# EAGLE design bdebounce (EAGLE 9.6.1)
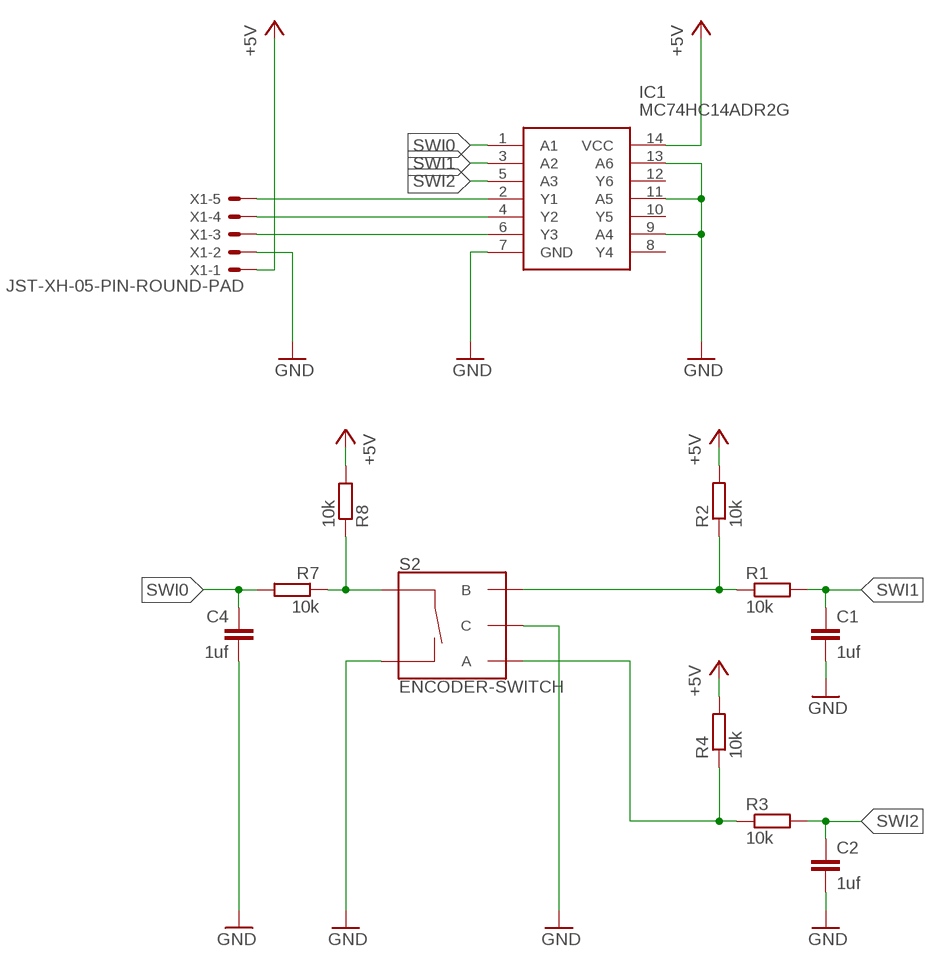
[diagram p0: schematic, sheet 1]

## Parts
C1  1uf  C-EUC0805  [C0805]
C2  1uf  C-EUC0805  [C0805]
C4  1uf  C-EUC0805  [C0805]
IC1  MC74HC14ADR2G  [SOIC127P600X175-14N]
R1  10k  R-EU_R0805  [R0805]
R2  10k  R-EU_R0805  [R0805]
R3  10k  R-EU_R0805  [R0805]
R4  10k  R-EU_R0805  [R0805]
R7  10k  R-EU_R0805  [R0805]
R8  10k  R-EU_R0805  [R0805]
S2  ENCODER-SWITCH  [ROTARY_ENC_PLAIN]
X1  JST-XH-05-PIN-ROUND-PAD  [JST-XH-05-PACKAGE-ROUND-PAD]

## Nets
+5V: IC1.14(VCC) R2.2 R4.2 R8.2 X1.1
GND: C1.2 C2.2 C4.2 IC1.7(GND) IC1.9(A4) IC1.11(A5) IC1.13(A6) S2.C S2.SW- X1.2
N$1: IC1.6(Y3) X1.3
SW0: R7.1 R8.1 S2.SW+
SW1: R1.1 R2.1 S2.B
SW2: R3.1 R4.1 S2.A
SWI0: C4.1 IC1.1(A1) R7.2
SWI1: C1.1 IC1.3(A2) R1.2
SWI2: C2.1 IC1.5(A3) R3.2
SWO0: IC1.2(Y1) X1.5
SWO1: IC1.4(Y2) X1.4
Unconnected: IC1.8(Y4) IC1.10(Y5) IC1.12(Y6)

## Library data of the parts
C1 C2 C4 = rcl:C-EU: CAPACITOR, European symbol; SPICEPREFIX: C
IC1 = MC74HC14ADR2G:MC74HC14ADR2G: ON SEMICONDUCTOR - MC74HC14ADR2G - IC, HEX INV, SCHMITT, 74HC14, SOIC14 Source: Datasheet <http://www.onsemi.com/pub/Collateral/MC74HC14A-D.PDF>; DESCRIPTION: ON SEMICONDUCTOR - MC74HC14ADR2G - IC, HEX INV, SCHMITT, 74HC14, SOIC14; HEIGHT: 1.75mm; MANUFACTURER_NAME: onsemi; MANUFACTURER_PART_NUMBER: MC74HC14ADR2G; MOUSER_PART_NUMBER: 863-MC74HC14ADR2G; MOUSER_PRICE-STOCK: https://www.mouser.co.uk/ProductDetail/onsemi/MC74HC14ADR2G?qs=qg33o%252B8vzFo3hr7qHLzKcg%3D%3D
R1-R4 R7 R8 = rcl:R-EU_: RESISTOR, European symbol; SPICEPREFIX: R
S2 = SparkFun-Switches:ENCODER-SWITCH: Rotary Encoder w/ Select Switch Encoders rotate similarly to potentiometers, but they’re different from potentiometers in that an encoder has full rotation without limits. They output gray code so that you can tell how much and in which direction the encoder has been turned. This encoder includes a push-down select switch built into the shaft. SparkFun Products Rotary Encoder <https://www.sparkfun.com/products/9117> (COM-09117); SF_SKU: COM-09117
X1 = Rembrandt Electronics - JST XH Connectors v1-0:JST-XH-05-PIN: JST XH Connector 2 Pin Wire to board connector. Pitch: 2,54 mm, (0.100") Number of pins: 5 Created by Rembrandt Electronics www.rembrandtelectronics.com

## Board
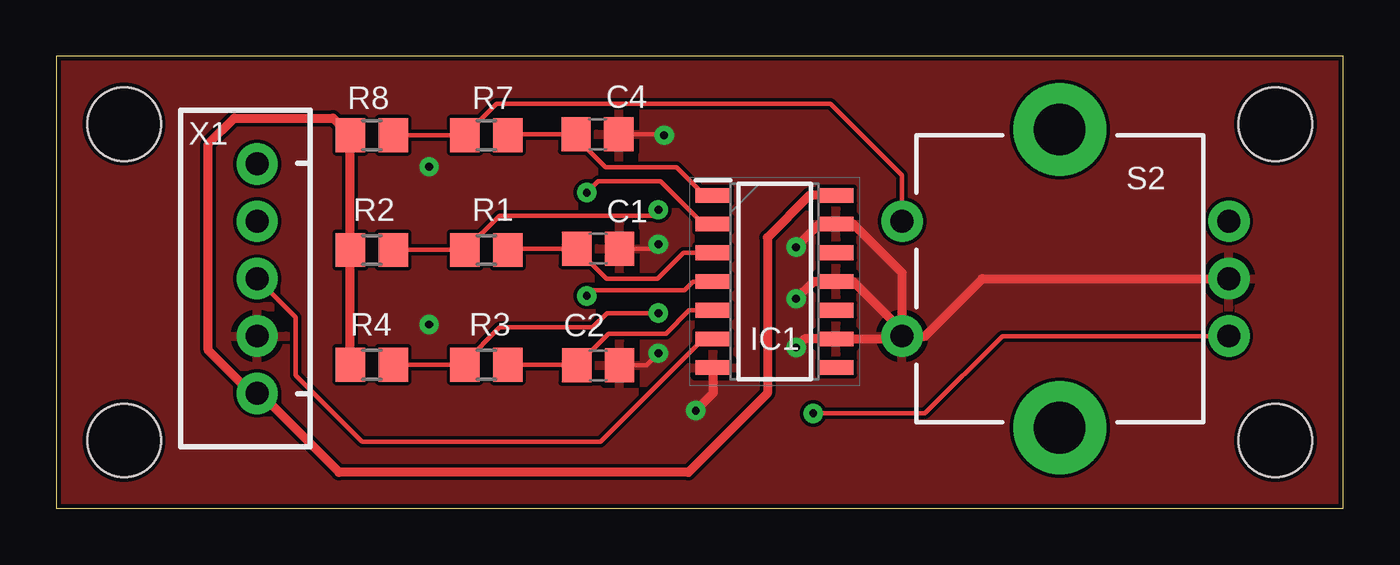
[diagram p1: board, top side]
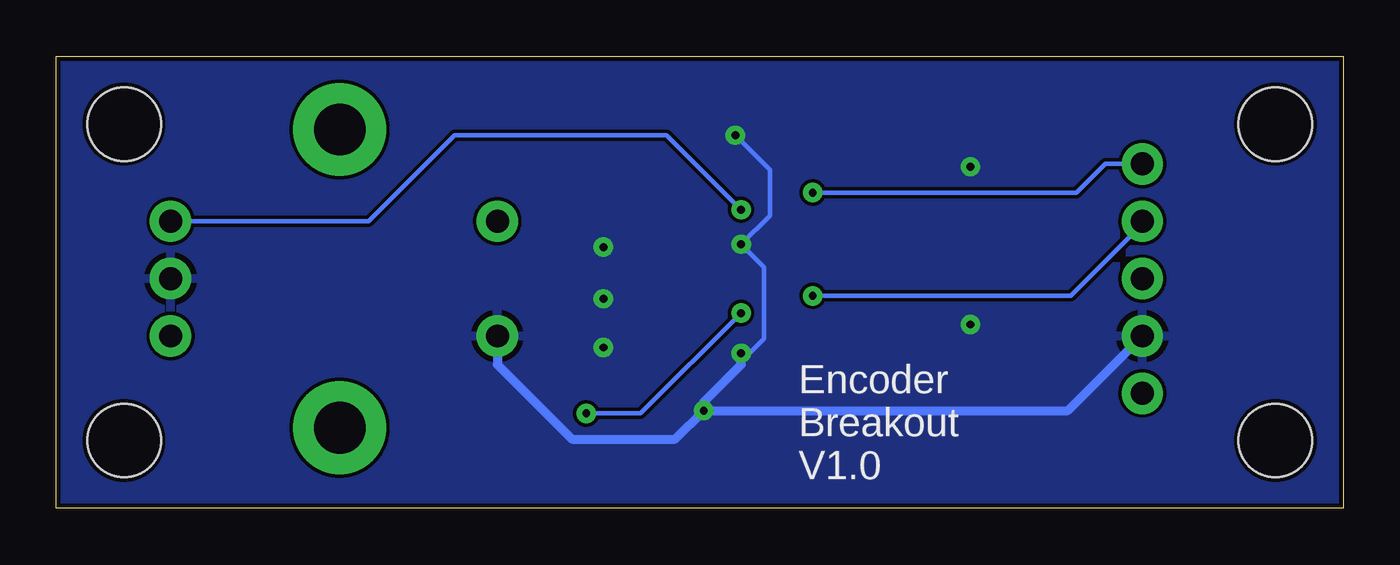
[diagram p2: board, bottom side, seen from below]

Size 57 x 20 mm. Coordinates in mm from the lower left corner, seen from the top.
Outline: 0,0 57,0 57,20 0,20 0,0
Copper layers (1*16): Top 0.035mm / dielectric 1.6mm / Bottom 0.035mm
Design rules "angelo-jlcpcb-2layers": minimum track width 8mil, minimum drill 0.3mm, track to track 6mil, track to pad 6mil, pad to pad 6mil, via to via 10mil, smd to smd 6mil, copper to edge 0.2mm, drill to drill 8mil, minimum pad ring 10mil, minimum via ring 10mil, stop-mask expansion 4mil, vias tented up to drill 0mil, thermal gap 10mil
Holes 3.25 mm at 3,17 54,17 3,3 54,3

### Footprints (pad centres in the part's own frame; a part is rotated, then mirrored left to right if it is on the bottom)
C0805 = smd 1.3 x 1.5: 1 -0.95,0; 2 0.95,0
SOIC127P600X175-14N = smd 1.55 x 0.65: 1 -2.725,3.81; 2 -2.725,2.54; 3 -2.725,1.27; 4 -2.725,0; 5 -2.725,-1.27; 6 -2.725,-2.54; 7 -2.725,-3.81; 8 2.725,-3.81; 9 2.725,-2.54; 10 2.725,-1.27; 11 2.725,0; 12 2.725,1.27; 13 2.725,2.54; 14 2.725,3.81
R0805 = smd 1.3 x 1.5: 1 -0.95,0; 2 0.95,0
ROTARY_ENC_PLAIN = drill 1.016: A 7.493,-2.54; B 7.493,2.54; C 7.493,0; SW+ -6.985,2.54; SW- -6.985,-2.54 | drill 2.286: P$3 0,6.604; P$4 0,-6.604
JST-XH-05-PACKAGE-ROUND-PAD = drill 1.016: 1 -5.08,0; 2 -2.54,0; 3 0,0; 4 2.54,0; 5 5.08,0

### Placement (x,y rotation side)
C1  24,11.49 0 top
C2  24,6.32 0 top
C4  23.97,16.56 0 top
IC1  31.82,10.03 0 top
R1  19.05,11.43 0 top
R2  13.97,11.43 180 top
R3  19.05,6.35 0 top
R4  13.97,6.35 180 top
R7  19.05,16.51 0 top
R8  13.97,16.51 180 top
S2  44.45,10.16 0 top
X1  8.89,10.16 90 top

### Tracks (layer width: path | path; a pad name or v marks a point on that pad's centre or on a via)
+5V
  Top 0.406: R4.2 R2.2 R8.2 12.26,17.27 7.87,17.27 6.73,16.13 6.73,6.99 8.64,5.08 X1.1 9.02,5.08 12.52,1.58 27.99,1.58 31.5,5.08 31.5,11.98 33.36,13.84 IC1.14
GND  (via drill 0.35)
  Top 0.203: C2.2 26.13,6.32 v26.67,6.86 | C1.2 26.48,11.49 v26.67,11.68 | C4.2 26.88,16.56 v26.92,16.51
  Top 0.406: S2.SW- 38.48,7.62 41.02,10.16 S2.C | S2.SW- 37.47,7.49 IC1.9 33.15,7.49 v32.77,7.11 | S2.SW- 37.47,7.87 35.31,10.03 IC1.11 33.53,10.03 v32.77,9.27 | S2.SW- 37.47,10.41 35.31,12.57 IC1.13 33.78,12.57 v32.77,11.56 | IC1.7 29.09,5.09 v28.32,4.32
  Bottom 0.203: v26.92,16.51 25.4,14.99 25.4,12.95 v26.67,11.68 25.65,10.67 25.65,7.49 26.29,6.86 v26.67,6.86
  Bottom 0.406: v28.32,4.32 12.19,4.32 X1.2 | S2.SW- 37.47,6.35 34.16,3.05 29.59,3.05 v28.32,4.32 | v28.32,4.32 28.32,4.7 26.67,6.35 v26.67,6.86
  other vias: 16.51,15.11 16.51,8.13
  pour Top: 0,0 0,20 57,20 57,0
  pour Bottom: 0,0 0,20 57,20 57,0
N$1
  Top 0.203: X1.3 10.59,8.46 10.59,5.88 13.54,2.93 24.11,2.93 28.67,7.49 IC1.6
SW0
  Top 0.203: R8.1 R7.1 19.5,17.91 34.29,17.91 37.47,14.73 S2.SW+
SW1  (via drill 0.35)
  Top 0.203: R2.1 R1.1 19.62,12.95 26.41,12.95 v26.67,13.21
  Bottom 0.203: v26.67,13.21 29.97,16.51 39.37,16.51 43.18,12.7 S2.B
SW2  (via drill 0.35)
  Top 0.203: R4.1 R3.1 18.1,6.46 19.64,8 23.75,8 24.38,8.64 v26.67,8.64 | v33.53,4.19 38.48,4.19 41.91,7.62 S2.A
  Bottom 0.203: v33.53,4.19 31.11,4.19 v26.67,8.64
SWI0
  Top 0.203: R7.2 20.05,16.56 22.86,16.56 | 22.86,16.56 C4.1 | IC1.1 28.71,13.84 27.47,15.09 24.33,15.09 22.86,16.56
SWI1
  Top 0.203: R1.2 20.06,11.49 C1.1 24.38,10.16 26.64,10.16 27.78,11.3 IC1.3
SWI2
  Top 0.203: R3.2 23.01,6.35 C2.1 24.45,7.72 27,7.72 28.03,8.76 IC1.5
SWO0  (via drill 0.35)
  Top 0.203: v23.5,13.97 24,14.48 26.75,14.48 28.66,12.57 IC1.2
  Bottom 0.203: X1.5 10.54,15.24 11.81,13.97 v23.5,13.97
SWO1  (via drill 0.35)
  Top 0.203: v23.5,9.4 23.75,9.65 27.82,9.65 28.2,10.03 IC1.4
  Bottom 0.203: v23.5,9.4 12.06,9.4 8.89,12.57 X1.4

### Text on the board
bPlace: Encoder / Breakout / V1.0